# EAGLE schematic afron_atmega328_PTH (EAGLE 6.1)
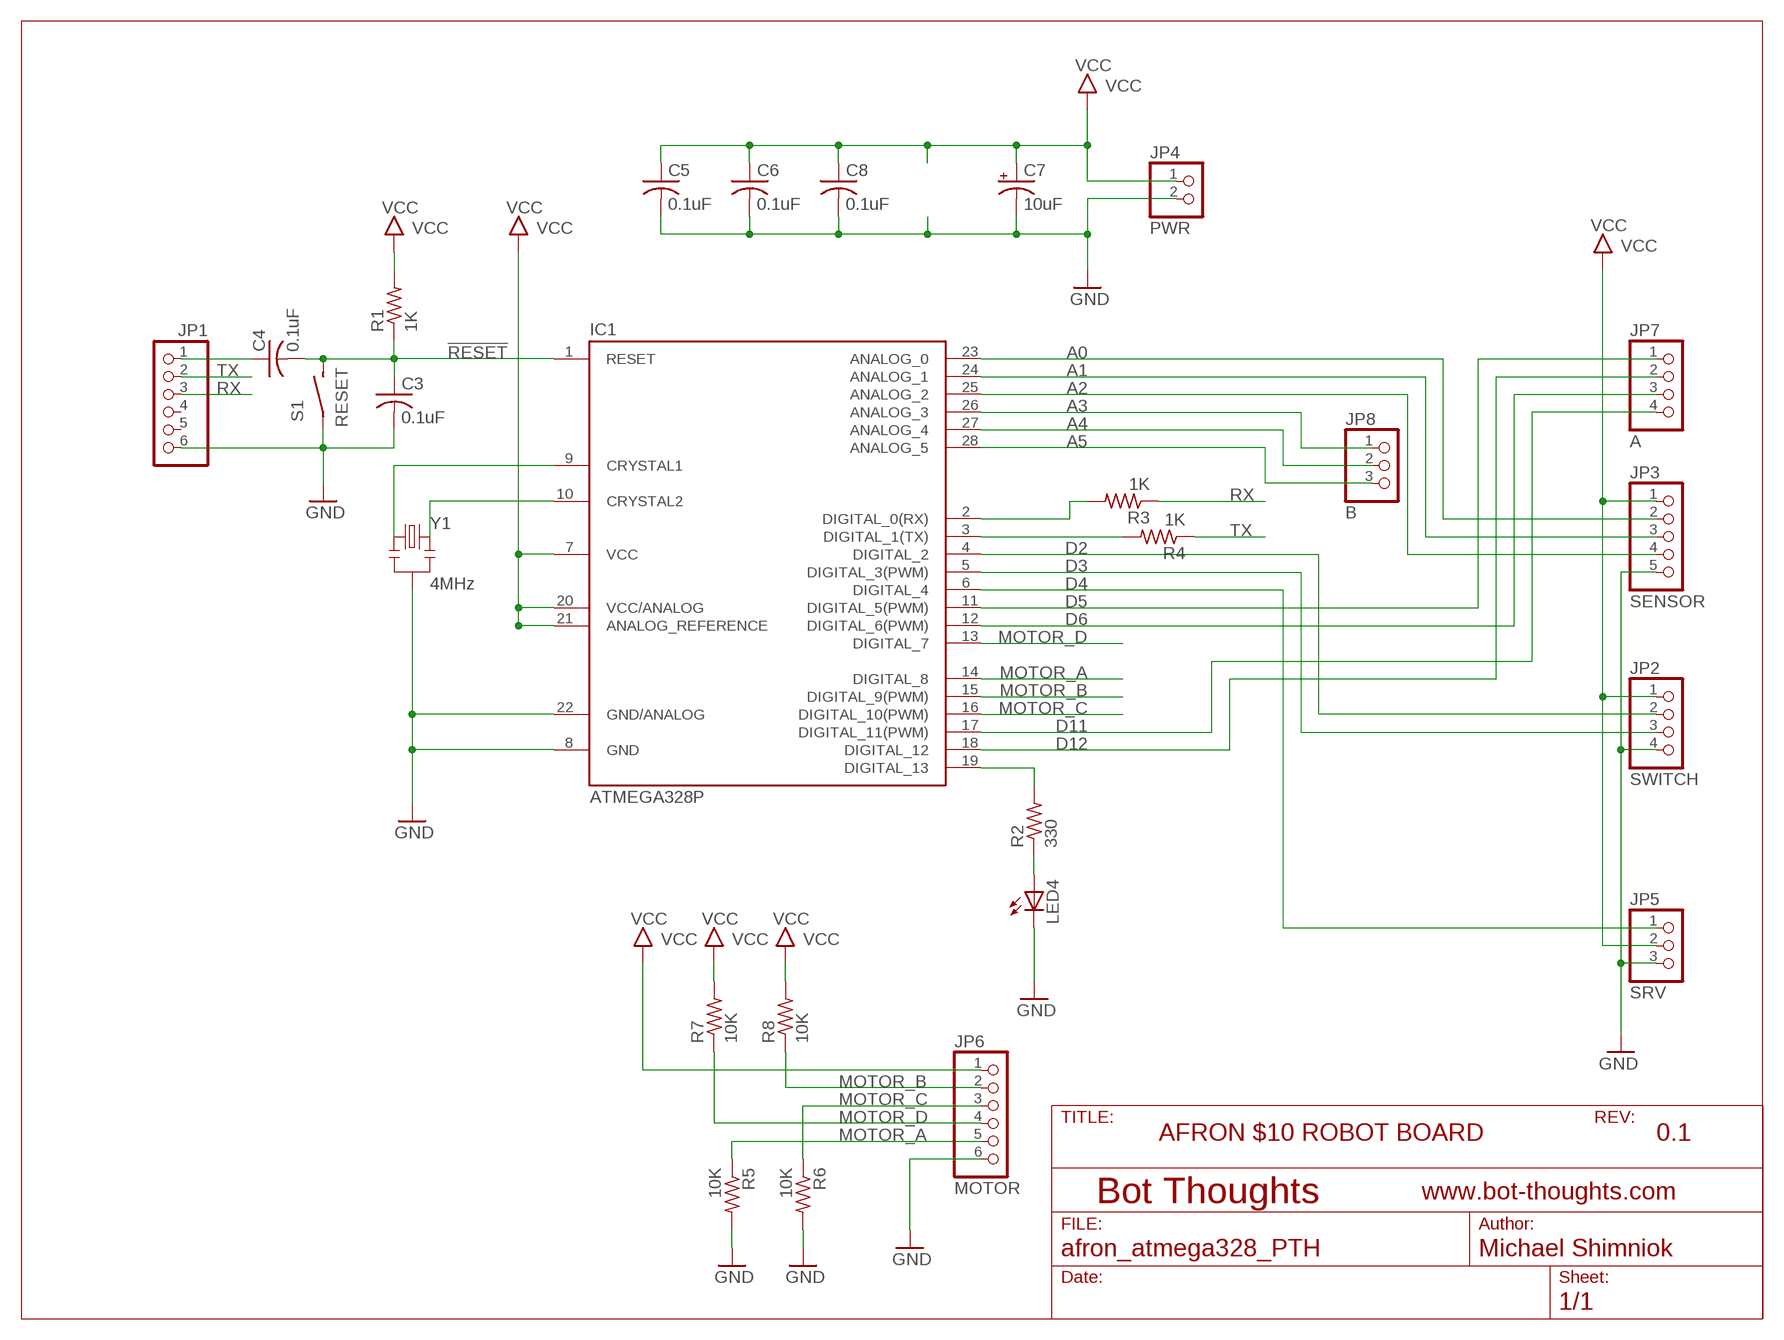
[diagram p0: schematic, sheet 1]

## Parts
C3  0.1uF  C-US050-024X044  [C050-024X044]
C4  0.1uF  C-US050-024X044  [C050-024X044]
C5  0.1uF  C-USC0603  [C0603]
C6  0.1uF  C-US050-024X044  [C050-024X044]
C7  10uF  CPOL-USE2.5-6  [E2,5-6]
C8  0.1uF  C-US050-024X044  [C050-024X044]
IC1  ATMEGA328P  ATMEGA168-PU  [DIL28-3]
JP1  PINHD-1X06_2.54-S  [1X06-S]
JP2  SWITCH  PINHD-1X04_2.54-S  [1X04-S]
JP3  SENSOR  PINHD-1X05_2.54-S  [1X05-S]
JP4  PWR  PINHD-1X02_2.54-S  [1X02-S]
JP5  SRV  PINHD-1X03_2.54-S  [1X03-S]
JP6  MOTOR  PINHD-1X06_2.54-S  [1X06-S]
JP7  A  PINHD-1X04_2.54-S  [1X04-S]
JP8  B  PINHD-1X03_2.54-S  [1X03-S]
LED4  LED3MM  [LED3MM]
R1  1K  R-US_0204/5  [0204/5]
R2  330  R-US_0204/5  [0204/5]
R3  1K  R-US_0204/5  [0204/5]
R4  1K  R-US_0204/5  [0204/5]
R5  10K  R-US_R0603  [R0603]
R6  10K  R-US_R0603  [R0603]
R7  10K  R-US_R0603  [R0603]
R8  10K  R-US_R0603  [R0603]
S1  RESET  SPST_TACT2  [6MMTACTILE]
Y1  4MHz  RESONATORPTH  [RESONATOR-PTH]

## Nets
!RESET: C3.1 C4.2 IC1.1(RESET) R1.1 S1.P$2(S)
A0: IC1.23(ANALOG_0) JP3.2
A1: IC1.24(ANALOG_1) JP3.3
A2: IC1.25(ANALOG_2) JP3.4
A3: IC1.26(ANALOG_3) JP8.1
A4: IC1.27(ANALOG_4) JP8.2
A5: IC1.28(ANALOG_5) JP8.3
D2: IC1.4(DIGITAL_2) JP2.2
D3: IC1.5(DIGITAL_3(PWM)) JP2.3
D4: IC1.6(DIGITAL_4) JP5.1
D5: IC1.11(DIGITAL_5(PWM)) JP7.1
D6: IC1.12(DIGITAL_6(PWM)) JP7.3
D11: IC1.17(DIGITAL_11(PWM)) JP7.4
D12: IC1.18(DIGITAL_12) JP7.2
D13: IC1.19(DIGITAL_13) R2.2
GND: C3.2 C5.2 C6.2 C7.- C8.2 IC1.8(GND) IC1.22(GND/ANALOG) JP1.6 JP2.4 JP3.5 JP4.2 JP5.3 JP6.6 LED4.K(C) R5.2 R6.2 S1.P$1(P) Y1.2
MOTOR_A: IC1.14(DIGITAL_8) JP6.5 R5.1
MOTOR_B: IC1.15(DIGITAL_9(PWM)) JP6.2 R8.1
MOTOR_C: IC1.16(DIGITAL_10(PWM)) JP6.3 R6.1
MOTOR_D: IC1.13(DIGITAL_7) JP6.4 R7.1
N$2: IC1.9(CRYSTAL1) Y1.1
N$3: IC1.10(CRYSTAL2) Y1.3
N$4: C4.1 JP1.1
N$6: LED4.A R2.1
N$8: IC1.3(DIGITAL_1(TX)) R4.2
N$9: IC1.2(DIGITAL_0(RX)) R3.2
RX: JP1.3 R3.1
TX: JP1.2 R4.1
VCC: C5.1 C6.1 C7.+ C8.1 IC1.7(VCC) IC1.20(VCC/ANALOG) IC1.21(ANALOG_REFERENCE) JP2.1 JP3.1 JP4.1 JP5.2 JP6.1 R1.2 R7.2 R8.2
Unconnected: JP1.4 JP1.5

## Notes on the sheet
- AFRON $10 ROBOT BOARD | 0.1

## Library data of the parts
C3-C6 C8 = rcl:C-US: CAPACITOR, American symbol
C7 = rcl:CPOL-US: POLARIZED CAPACITOR, American symbol
IC1 = Arduino-AVR:ATMEGA168-PU
JP1 JP6 = pinhead-2:PINHD-1X06: PIN HEADER
JP2 JP7 = pinhead-2:PINHD-1X04: PIN HEADER
JP3 = pinhead-2:PINHD-1X05: PIN HEADER
JP4 = pinhead-2:PINHD-1X02: PIN HEADER
JP5 JP8 = pinhead-2:PINHD-1X03: PIN HEADER
LED4 = led:LED: LED OSRAM: - CHIPLED LG R971, LG N971, LY N971, LG Q971, LY Q971, LO R971, LY R971 LH N974, LH R974 LS Q976, LO Q976, LY Q976 LO Q996 - Hyper CHIPLED LW Q18S LB Q993, LB Q99A, LB R99A - SideLED LS A670, LO A670, LY A670, LG A670, LP A670 LB A673, LV A673, LT A673, LW A673 LH A674 LY A675 LS A676, LA A676, LO A676, LY A676, LW A676 LS A679, LY A679, LG A679 - Hyper Micro SIDELED® LS Y876, LA Y876, LO Y876, LY Y876 LT Y87S - SmartLED LW L88C, LW L88S LB L89C, LB L89S, LG L890 LS L89K, LO L89K, LY L89K LS L896, LA L896, LO L896, LY L896 - TOPLED LS T670, LO T670, LY T670, LG T670, LP T670 LSG T670, LSP T670, LSY T670, LOP T670, LYG T670 LG T671, LOG T671, LSG T671 LB T673, LV T673, LT T673, LW T673 LH T674 LS T676, LA T676, LO T676, LY T676, LB T676, LH T676, LSB T676, LW T676 LB T67C, LV T67C, LT T67C, LS T67K, LO T67K, LY T67K, LW E67C LS E67B, LA E67B, LO E67B, LY E67B, LB E67C, LV E67C, LT E67C LW T67C LS T679, LY T679, LG T679 LS T770, LO T770, LY T770, LG T770, LP T770 LB T773, LV T773, LT T773, LW T773 LH T774 LS E675, LA E675, LY E675, LS T675 LS T776, LA T776, LO T776, LY T776, LB T776 LHGB T686 LT T68C, LB T68C - Hyper Mini TOPLED® LB M676 - Mini TOPLED Santana® LG M470 LS M47K, LO M47K, LY M47K Source: http://www.osram.convergy.de LUXEON: - LUMILED® LXK2-PW12-R00, LXK2-PW12-S00, LXK2-PW14-U00, LXK2-PW14-V00 LXK2-PM12-R00, LXK2-PM12-S00, LXK2-PM14-U00 LXK2-PE12-Q00, LXK2-PE12-R00, LXK2-PE12-S00, LXK2-PE14-T00, LXK2-PE14-U00 LXK2-PB12-K00, LXK2-PB12-L00, LXK2-PB12-M00, LXK2-PB14-N00, LXK2-PB14-P00, LXK2-PB14-Q00 LXK2-PR12-L00, LXK2-PR12-M00, LXK2-PR14-Q00, LXK2-PR14-R00 LXK2-PD12-Q00, LXK2-PD12-R00, LXK2-PD12-S00 LXK2-PH12-R00, LXK2-PH12-S00 LXK2-PL12-P00, LXK2-PL12-Q00, LXK2-PL12-R00 Source: www.luxeon.com KINGBRIGHT: KA-3528ASYC Source: www.kingbright.com
R1-R8 = resistor:R-US_: RESISTOR, American symbol
S1 = mes_electromech:SPST: SPST SWITCH
Y1 = SparkFun:RESONATOR: Resonator Small SMD resonator. This is the itty bitty 10/20MHz resonators with built in caps. CSTCE10M0G55 and CSTCE20M0V53. Footprint has been reviewed closely but hasn't been tested yet.